# EAGLE design boost gauge V1.1 (EAGLE 5.07)
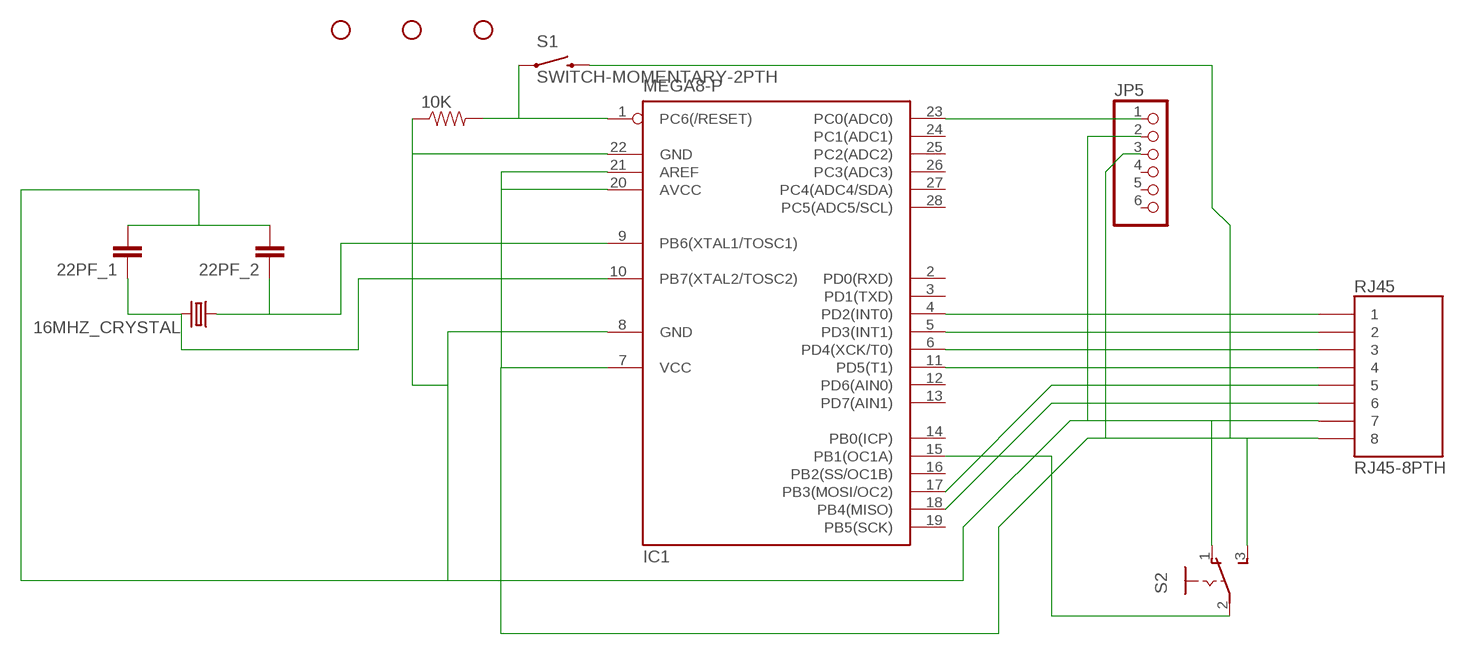
[diagram p0: schematic, sheet 1]

## Parts
10K  RESISTORPTH1  [AXIAL-0.3]
16MHZ_CRYSTAL  CRYSTALHC49UV  [HC49U-V]
22PF_1  CAPPTH  [CAP-PTH-SMALL]
22PF_2  CAPPTH  [CAP-PTH-SMALL]
IC1  MEGA8-P  [DIL28-3]
JP1  STAND-OFF  [STAND-OFF]
JP2  STAND-OFF  [STAND-OFF]
JP3  STAND-OFF  [STAND-OFF]
JP5  PINHD-1X6  [1X06]
RJ45  RJ45-8PTH  [RJ45-8]
S1  SWITCH-MOMENTARY-2PTH  [TACTILE-PTH]
S2  255SB  [255SB]

## Nets
N$1: 10K.P$1 22PF_1.2 22PF_2.2 IC1.8(GND) IC1.22(GND) JP5.2 RJ45.7 S2.1(O)
N$2: 16MHZ_CRYSTAL.2 22PF_1.1 IC1.10(PB7(XTAL2/TOSC2))
N$3: 10K.P$2 IC1.1(PC6(/RESET)) S1.1
N$4: IC1.6(PD4(XCK/T0)) RJ45.3
N$5: IC1.15(PB1(OC1A)) S2.2(P)
N$6: IC1.23(PC0(ADC0)) JP5.1
N$7: IC1.7(VCC) IC1.20(AVCC) IC1.21(AREF) JP5.3 RJ45.8 S1.3 S2.3(S)
N$9: 16MHZ_CRYSTAL.1 22PF_2.1 IC1.9(PB6(XTAL1/TOSC1))
N$10: IC1.4(PD2(INT0)) RJ45.1
N$11: IC1.5(PD3(INT1)) RJ45.2
N$13: IC1.11(PD5(T1)) RJ45.4
N$14: IC1.17(PB3(MOSI/OC2)) RJ45.5
N$15: IC1.18(PB4(MISO)) RJ45.6
Unconnected: IC1.2(PD0(RXD)) IC1.3(PD1(TXD)) IC1.12(PD6(AIN0)) IC1.13(PD7(AIN1)) IC1.14(PB0(ICP)) IC1.16(PB2(SS/OC1B)) IC1.19(PB5(SCK)) IC1.24(PC1(ADC1)) IC1.25(PC2(ADC2)) IC1.26(PC3(ADC3)) IC1.27(PC4(ADC4/SDA)) IC1.28(PC5(ADC5/SCL)) JP5.4 JP5.5 JP5.6

## Library data of the parts
10K = SparkFun:RESISTOR: Resistor Basic schematic elements and footprints for 0603, 1206, and PTH 1/10th watt (small) resistors.
16MHZ_CRYSTAL = SparkFun:CRYSTAL: Crystals Various standard crystals. Proven footprints. Spark Fun Electronics SKU : COM-00534
22PF_1 22PF_2 = SparkFun:CAP: Capacitor Standard 0603 ceramic capacitor, and 0.1" leaded capacitor.
IC1 = atmel:MEGA8-P: MICROCONTROLLER 8 Kbytes FLASH, 1 kbytes SRAM, 512 bytes EEPROM, USART, 4-channel 10 bit ADC, 2-channel 8 bit ADC Pin compatible with Atmega48, ATMega88, ATMega168 Source: avr.lbr
JP1-JP3 = SparkFun:STAND-OFF: Stand Off This is the mechanical footprint for a #4 phillips button head screw. Use the keepout ring to avoid running the screw head into surrounding components. SKU : PRT-00447
JP5 = pinhead:PINHD-1X6: PIN HEADER
RJ45 = SparkFun:RJ45-8: RJ45 Jack Simple RJ45, 8-pin connection - connector for common Cat5, Cat5e, and Cat6 Ethernet cables. Footprint not yet proven in production. Connector sku is PRT-00643; Breakout PCB sku is BOB-00716.
S1 = SparkFun:SWITCH-MOMENTARY-2
S2 = switch:255SB: SLIDING SWITCH Distributor Buerklin, 11G810

## Board
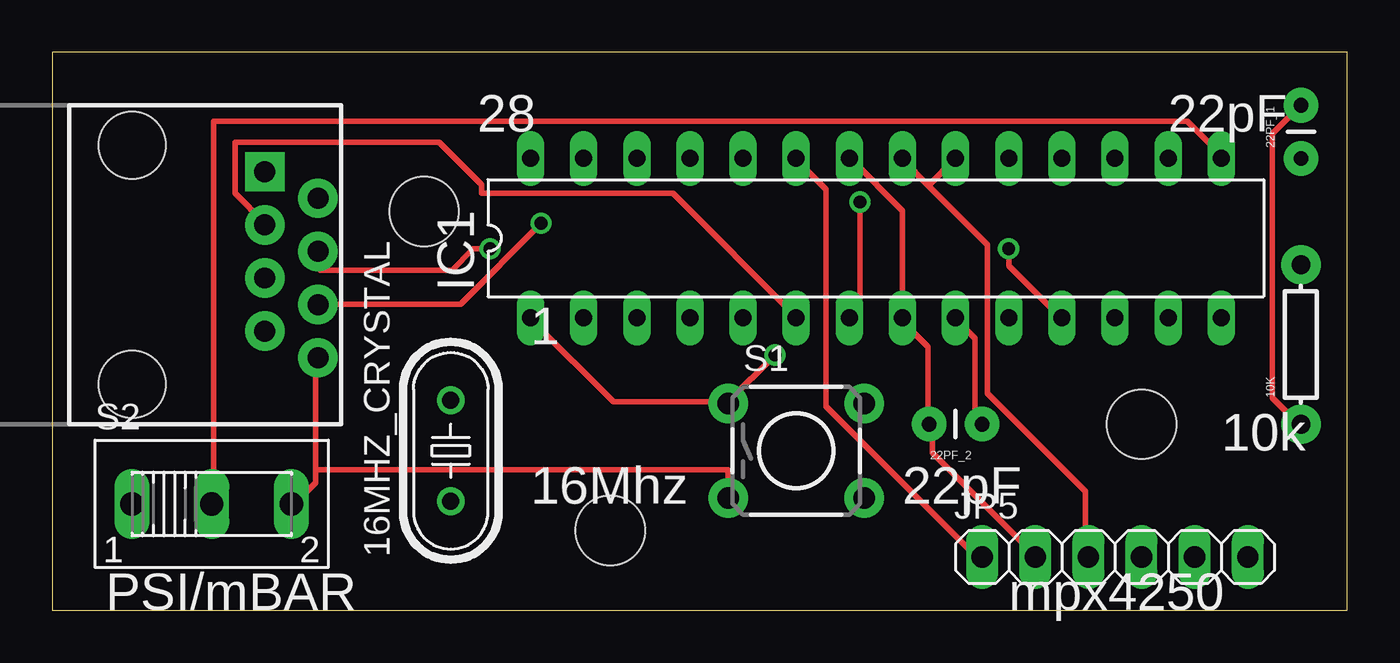
[diagram p1: board, top side]
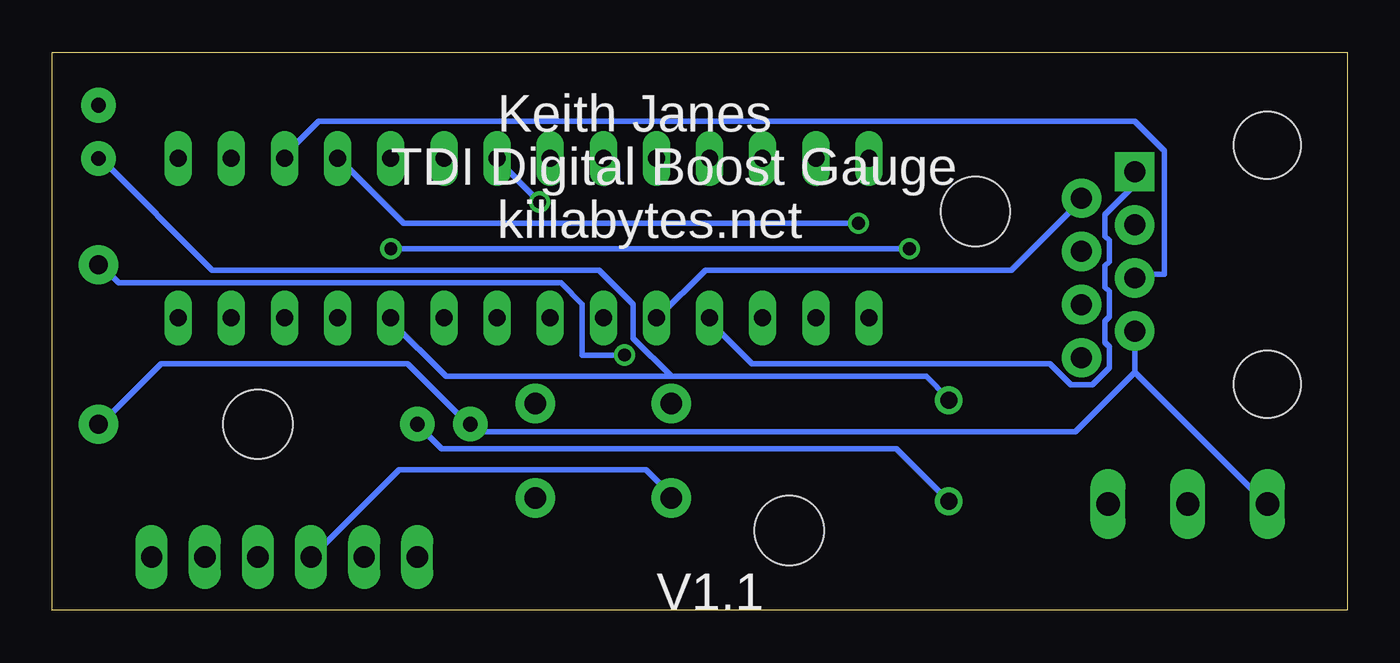
[diagram p2: board, bottom side, seen from below]

Size 61.9 x 26.66 mm. Coordinates in mm from the lower left corner, seen from the top.
Outline: 0,0 61.9,0 61.9,26.66 0,26.66 0,0
Copper layers (1*16): Top 0.035mm / dielectric 1.5mm / Bottom 0.035mm
Design rules "default": minimum track width 10mil, minimum drill 24mil, track to track 8mil, track to pad 8mil, pad to pad 8mil, via to via 8mil, smd to smd 8mil, copper to edge 40mil, drill to drill 8mil, minimum pad ring 10mil, minimum via ring 8mil, stop-mask expansion 4mil, vias tented up to drill 0mil, thermal gap 10mil

### Footprints (pad centres in the part's own frame; a part is rotated, then mirrored left to right if it is on the bottom)
AXIAL-0.3 = drill 0.9 pad 1.88 round: P$1 -3.81,0; P$2 3.81,0
HC49U-V = drill 0.813 round: 1 -2.413,0; 2 2.413,0
CAP-PTH-SMALL = drill 0.7 pad 1.651 round: 1 0,0; 2 2.54,0
DIL28-3 = drill 0.813 long: 1 -16.51,-3.81; 2 -13.97,-3.81; 3 -11.43,-3.81; 4 -8.89,-3.81; 5 -6.35,-3.81; 6 -3.81,-3.81; 7 -1.27,-3.81; 8 1.27,-3.81; 9 3.81,-3.81; 10 6.35,-3.81; 11 8.89,-3.81; 12 11.43,-3.81; 13 13.97,-3.81; 14 16.51,-3.81; 15 16.51,3.81; 16 13.97,3.81; 17 11.43,3.81; 18 8.89,3.81; 19 6.35,3.81; 20 3.81,3.81; 21 1.27,3.81; 22 -1.27,3.81; 23 -3.81,3.81; 24 -6.35,3.81; 25 -8.89,3.81; 26 -11.43,3.81; 27 -13.97,3.81; 28 -16.51,3.81
STAND-OFF = hole 3.302: 0,0
1X06 = drill 1.016 long: 1 -6.35,0; 2 -3.81,0; 3 -1.27,0; 4 1.27,0; 5 3.81,0; 6 6.35,0
RJ45-8 = drill 1 pad 1.88 square: 1 -4.445,6.35 | drill 1 pad 1.88 round: 2 -3.175,8.89; 3 -1.905,6.35; 4 -0.635,8.89; 5 0.635,6.35; 6 1.905,8.89; 7 3.175,6.35; 8 4.445,8.89 | hole 3.2: -5.715,0; 5.715,0
TACTILE-PTH = drill 1.016 pad 1.88 round: 1 -3.251,2.261; 2 3.251,2.261; 3 -3.251,-2.261; 4 3.251,-2.261
255SB = drill 1.118 long: 1 -3.81,0; 2 0,0; 3 3.81,0

### Placement (x,y rotation side)
10K  59.69,12.7 90 top
16MHZ_CRYSTAL  19.05,7.62 90 top
22PF_1  59.69,21.59 90 top
22PF_2  44.45,8.89 180 top
IC1  39.37,17.78 0 top
JP1  52.07,8.89 0 top
JP2  17.78,19.05 0 top
JP3  26.67,3.81 0 top
JP5  50.8,2.54 0 top
RJ45  3.81,16.51 270 top
S1  35.56,7.62 0 top
S2  7.62,5.08 0 top

### Tracks (layer width: path | path; a pad name or v marks a point on that pad's centre or on a via)
N$1
  Top 0.254: 22PF_1.2 58.32,22.76 58.32,10.16 59.54,8.94 10K.P$1 | IC1.22 38.2,21.54 40.64,19.1 IC1.8 40.64,13.82 41.86,12.6 41.86,8.94 22PF_2.2 42.06,8.74 42.06,7.52 46.94,2.64 JP5.2
  Bottom 0.254: 10.16,11.38 3.86,5.08 S2.1 | 10.16,11.38 RJ45.7 | 10.16,11.38 13.01,8.53 41.66,8.53 41.86,8.74 22PF_2.2 42.06,8.94 44.91,11.79 56.69,11.79 59.54,8.94 10K.P$1
N$2
  Bottom 0.254: 32.31,11.18 43.08,11.18 45.72,13.82 IC1.10 | 32.31,11.18 20.12,11.18 19.1,10.16 16MHZ_CRYSTAL.2 | 32.31,11.18 34.14,13.01 34.14,14.63 35.76,16.26 54.25,16.26 59.54,21.54 22PF_1.1
N$3  (via drill 0.61)
  Top 0.254: 32.31,9.96 26.82,9.96 22.96,13.82 IC1.1 | 32.31,9.96 v34.54,12.19 | 32.31,9.96 S1.1
  Bottom 0.254: v34.54,12.19 36.58,12.19 36.58,14.63 37.59,15.65 58.73,15.65 59.54,16.46 10K.P$2
N$4
  Top 0.254: IC1.6 35.56,14.02 29.67,19.91 20.52,19.91 20.52,20.32 18.49,22.35 8.74,22.35 8.74,19.91 10.16,18.49 RJ45.3
N$5
  Top 0.254: IC1.15 55.88,21.74 54.25,23.37 7.72,23.37 7.72,5.08 S2.2
N$6
  Top 0.254: IC1.23 35.56,21.54 36.98,20.12 36.98,9.75 44.3,2.44 JP5.1
N$7  (via drill 0.61)
  Top 0.254: 12.6,6.71 12.6,11.99 RJ45.8 | 12.6,6.71 12.6,6.1 11.58,5.08 S2.3 | v38.61,19.51 38.61,14.43 38.2,14.02 IC1.7 | 41.88,20.3 44.7,17.48 44.7,10.36 49.38,5.69 49.38,2.64 JP5.3 | 41.88,20.3 40.64,21.54 IC1.21 | 12.6,6.71 32.31,6.71 S1.3 | 41.88,20.3 IC1.20
  Bottom 0.254: v38.61,19.51 40.64,21.54 IC1.21 | JP5.3 49.38,2.64 45.31,6.71 33.53,6.71 32.31,5.49 S1.3
N$9
  Top 0.254: IC1.9 43.28,13.82 44.09,13.01 44.09,9.14 44.3,8.94 22PF_2.1
  Bottom 0.254: 16MHZ_CRYSTAL.1 19.1,5.28 21.54,7.72 43.28,7.72 22PF_2.1
N$10
  Bottom 0.254: IC1.4 30.48,13.82 28.45,11.79 14.22,11.79 13.21,10.77 12.19,10.77 11.38,11.58 11.38,12.6 11.58,12.8 11.58,13.82 11.38,14.02 11.38,15.24 11.58,15.44 11.58,16.46 11.38,16.66 11.38,17.68 11.58,17.88 11.58,18.9 10.16,20.32 RJ45.1
N$11
  Bottom 0.254: IC1.5 32.92,14.02 30.68,16.26 16.05,16.26 12.8,19.51 RJ45.2
N$13  (via drill 0.61)
  Top 0.254: v45.72,17.27 45.72,16.46 48.16,14.02 IC1.11 | v20.93,17.27 20.12,17.27 19.1,16.26 12.8,16.26 12.8,17.07 RJ45.4
  Bottom 0.254: v20.93,17.27 v45.72,17.27
N$14
  Bottom 0.254: IC1.17 50.8,21.74 49.17,23.37 10.16,23.37 8.74,21.95 8.74,16.05 10.16,16.05 RJ45.5
N$15  (via drill 0.61)
  Top 0.254: v23.37,18.49 19.51,14.63 12.8,14.63 RJ45.6
  Bottom 0.254: v23.37,18.49 45.11,18.49 48.16,21.54 IC1.18

### Text on the board
tPlace: 28 | 22pF | 1 | 10k | 16Mhz | 22pF | PSI/mBAR | mpx4250
bPlace: Keith Janes | TDI Digital Boost Gauge | killabytes.net | V1.1